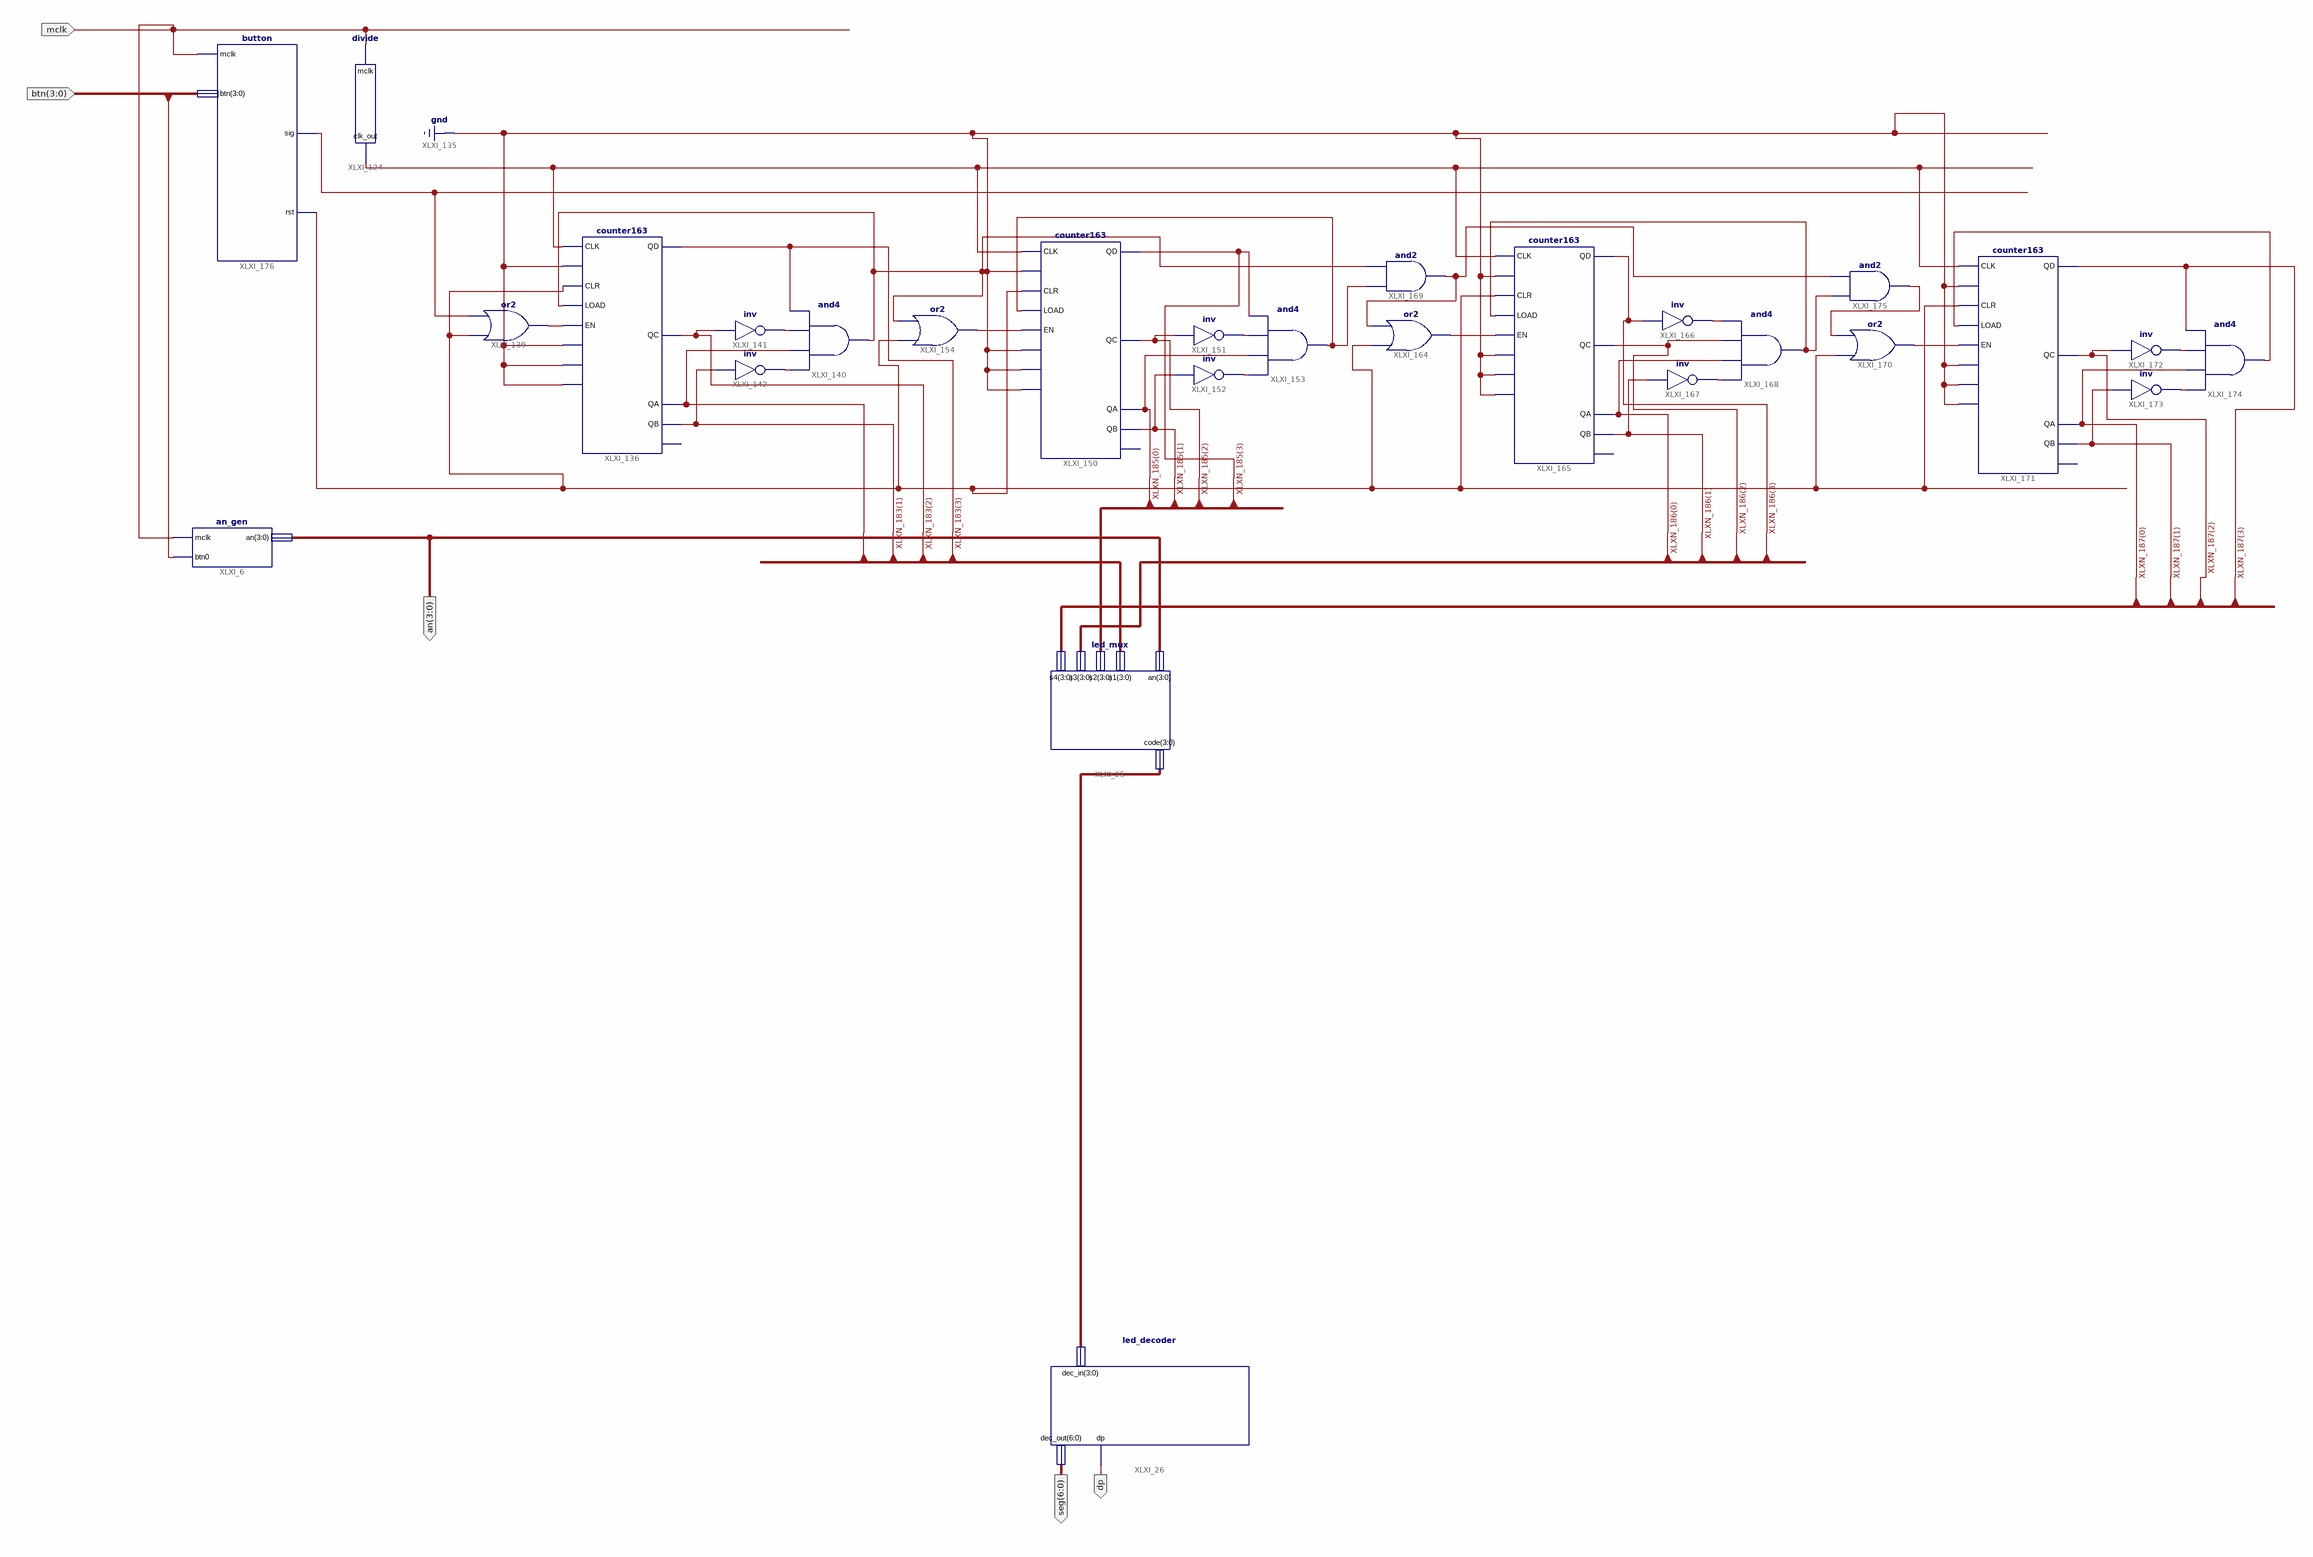
[diagram p0: schematic sheet 1]
// Xilinx ISE schematic main - 副本.sch (spartan3e) as structural Verilog: 27 symbols, 5 ports
module \main_-_副本  (
  input  [3:0] btn,
  input  mclk,
  output [3:0] an,
  output [6:0] seg,
  output dp
);

  wire XIL, XLXN_77, XLXN_82, XLXN_83, XLXN_103, XLXN_105, XLXN_106, XLXN_110, XLXN_115, XLXN_140, XLXN_141,
       XLXN_143, XLXN_147, XLXN_151, XLXN_155, XLXN_156, XLXN_157, XLXN_158, XLXN_162, XLXN_167, XLXN_170;
  wire [3:0] XLXN_37, XLXN_183, XLXN_185, XLXN_186, XLXN_187;

  an_gen XLXI_6 (.mclk(mclk), .btn0(btn[0]), .an(an));
  divide XLXI_124 (.mclk(mclk), .clk_out(XLXN_170));
  counter163 XLXI_136 (
    .CLK(XLXN_170), .A(1'b0), .CLR(XIL), .LOAD(XLXN_115), .EN(XLXN_77), .B(1'b0), .C(1'b0), .D(1'b0),
    .QD(XLXN_183[3]), .QC(XLXN_183[2]), .QA(XLXN_183[0]), .QB(XLXN_183[1]));  // open: RCD
  or XLXI_139 (XLXN_77, XIL, XLXN_151);
  and XLXI_140 (XLXN_115, XLXN_83, XLXN_183[0], XLXN_82, XLXN_183[3]);
  not XLXI_141 (XLXN_82, XLXN_183[2]);
  not XLXI_142 (XLXN_83, XLXN_183[1]);
  or XLXI_154 (XLXN_103, XIL, XLXN_115);
  counter163 XLXI_150 (
    .CLK(XLXN_170), .A(1'b0), .CLR(XIL), .LOAD(XLXN_110), .EN(XLXN_103), .B(1'b0), .C(1'b0), .D(1'b0),
    .QD(XLXN_185[3]), .QC(XLXN_185[2]), .QA(XLXN_185[0]), .QB(XLXN_185[1]));  // open: RCD
  not XLXI_151 (XLXN_105, XLXN_185[2]);
  not XLXI_152 (XLXN_106, XLXN_185[1]);
  and XLXI_153 (XLXN_110, XLXN_106, XLXN_185[0], XLXN_105, XLXN_185[3]);
  or XLXI_164 (XLXN_141, XIL, XLXN_140);
  counter163 XLXI_165 (
    .CLK(XLXN_170), .A(1'b0), .CLR(XIL), .LOAD(XLXN_147), .EN(XLXN_141), .B(1'b0), .C(1'b0), .D(1'b0),
    .QD(XLXN_186[3]), .QC(XLXN_186[2]), .QA(XLXN_186[0]), .QB(XLXN_186[1]));  // open: RCD
  not XLXI_167 (XLXN_143, XLXN_186[1]);
  and XLXI_168 (XLXN_147, XLXN_143, XLXN_186[0], XLXN_186[2], XLXN_167);
  and XLXI_169 (XLXN_140, XLXN_110, XLXN_115);
  or XLXI_170 (XLXN_156, XIL, XLXN_155);
  counter163 XLXI_171 (
    .CLK(XLXN_170), .A(1'b0), .CLR(XIL), .LOAD(XLXN_162), .EN(XLXN_156), .B(1'b0), .C(1'b0), .D(1'b0),
    .QD(XLXN_187[3]), .QC(XLXN_187[2]), .QA(XLXN_187[0]), .QB(XLXN_187[1]));  // open: RCD
  not XLXI_172 (XLXN_157, XLXN_187[2]);
  not XLXI_173 (XLXN_158, XLXN_187[1]);
  and XLXI_174 (XLXN_162, XLXN_158, XLXN_187[0], XLXN_157, XLXN_187[3]);
  and XLXI_175 (XLXN_155, XLXN_147, XLXN_140);
  not XLXI_166 (XLXN_167, XLXN_186[3]);
  button XLXI_176 (.mclk(mclk), .btn(btn), .sig(XLXN_151), .rst(XIL));
  led_mux XLXI_25 (.an(an), .code(XLXN_37), .s1(XLXN_183), .s2(XLXN_185), .s3(XLXN_186), .s4(XLXN_187));
  led_decoder XLXI_26 (.dec_in(XLXN_37), .dp(dp), .dec_out(seg));
endmodule
